# Altium project PCB_TXmodule.PrjPcb
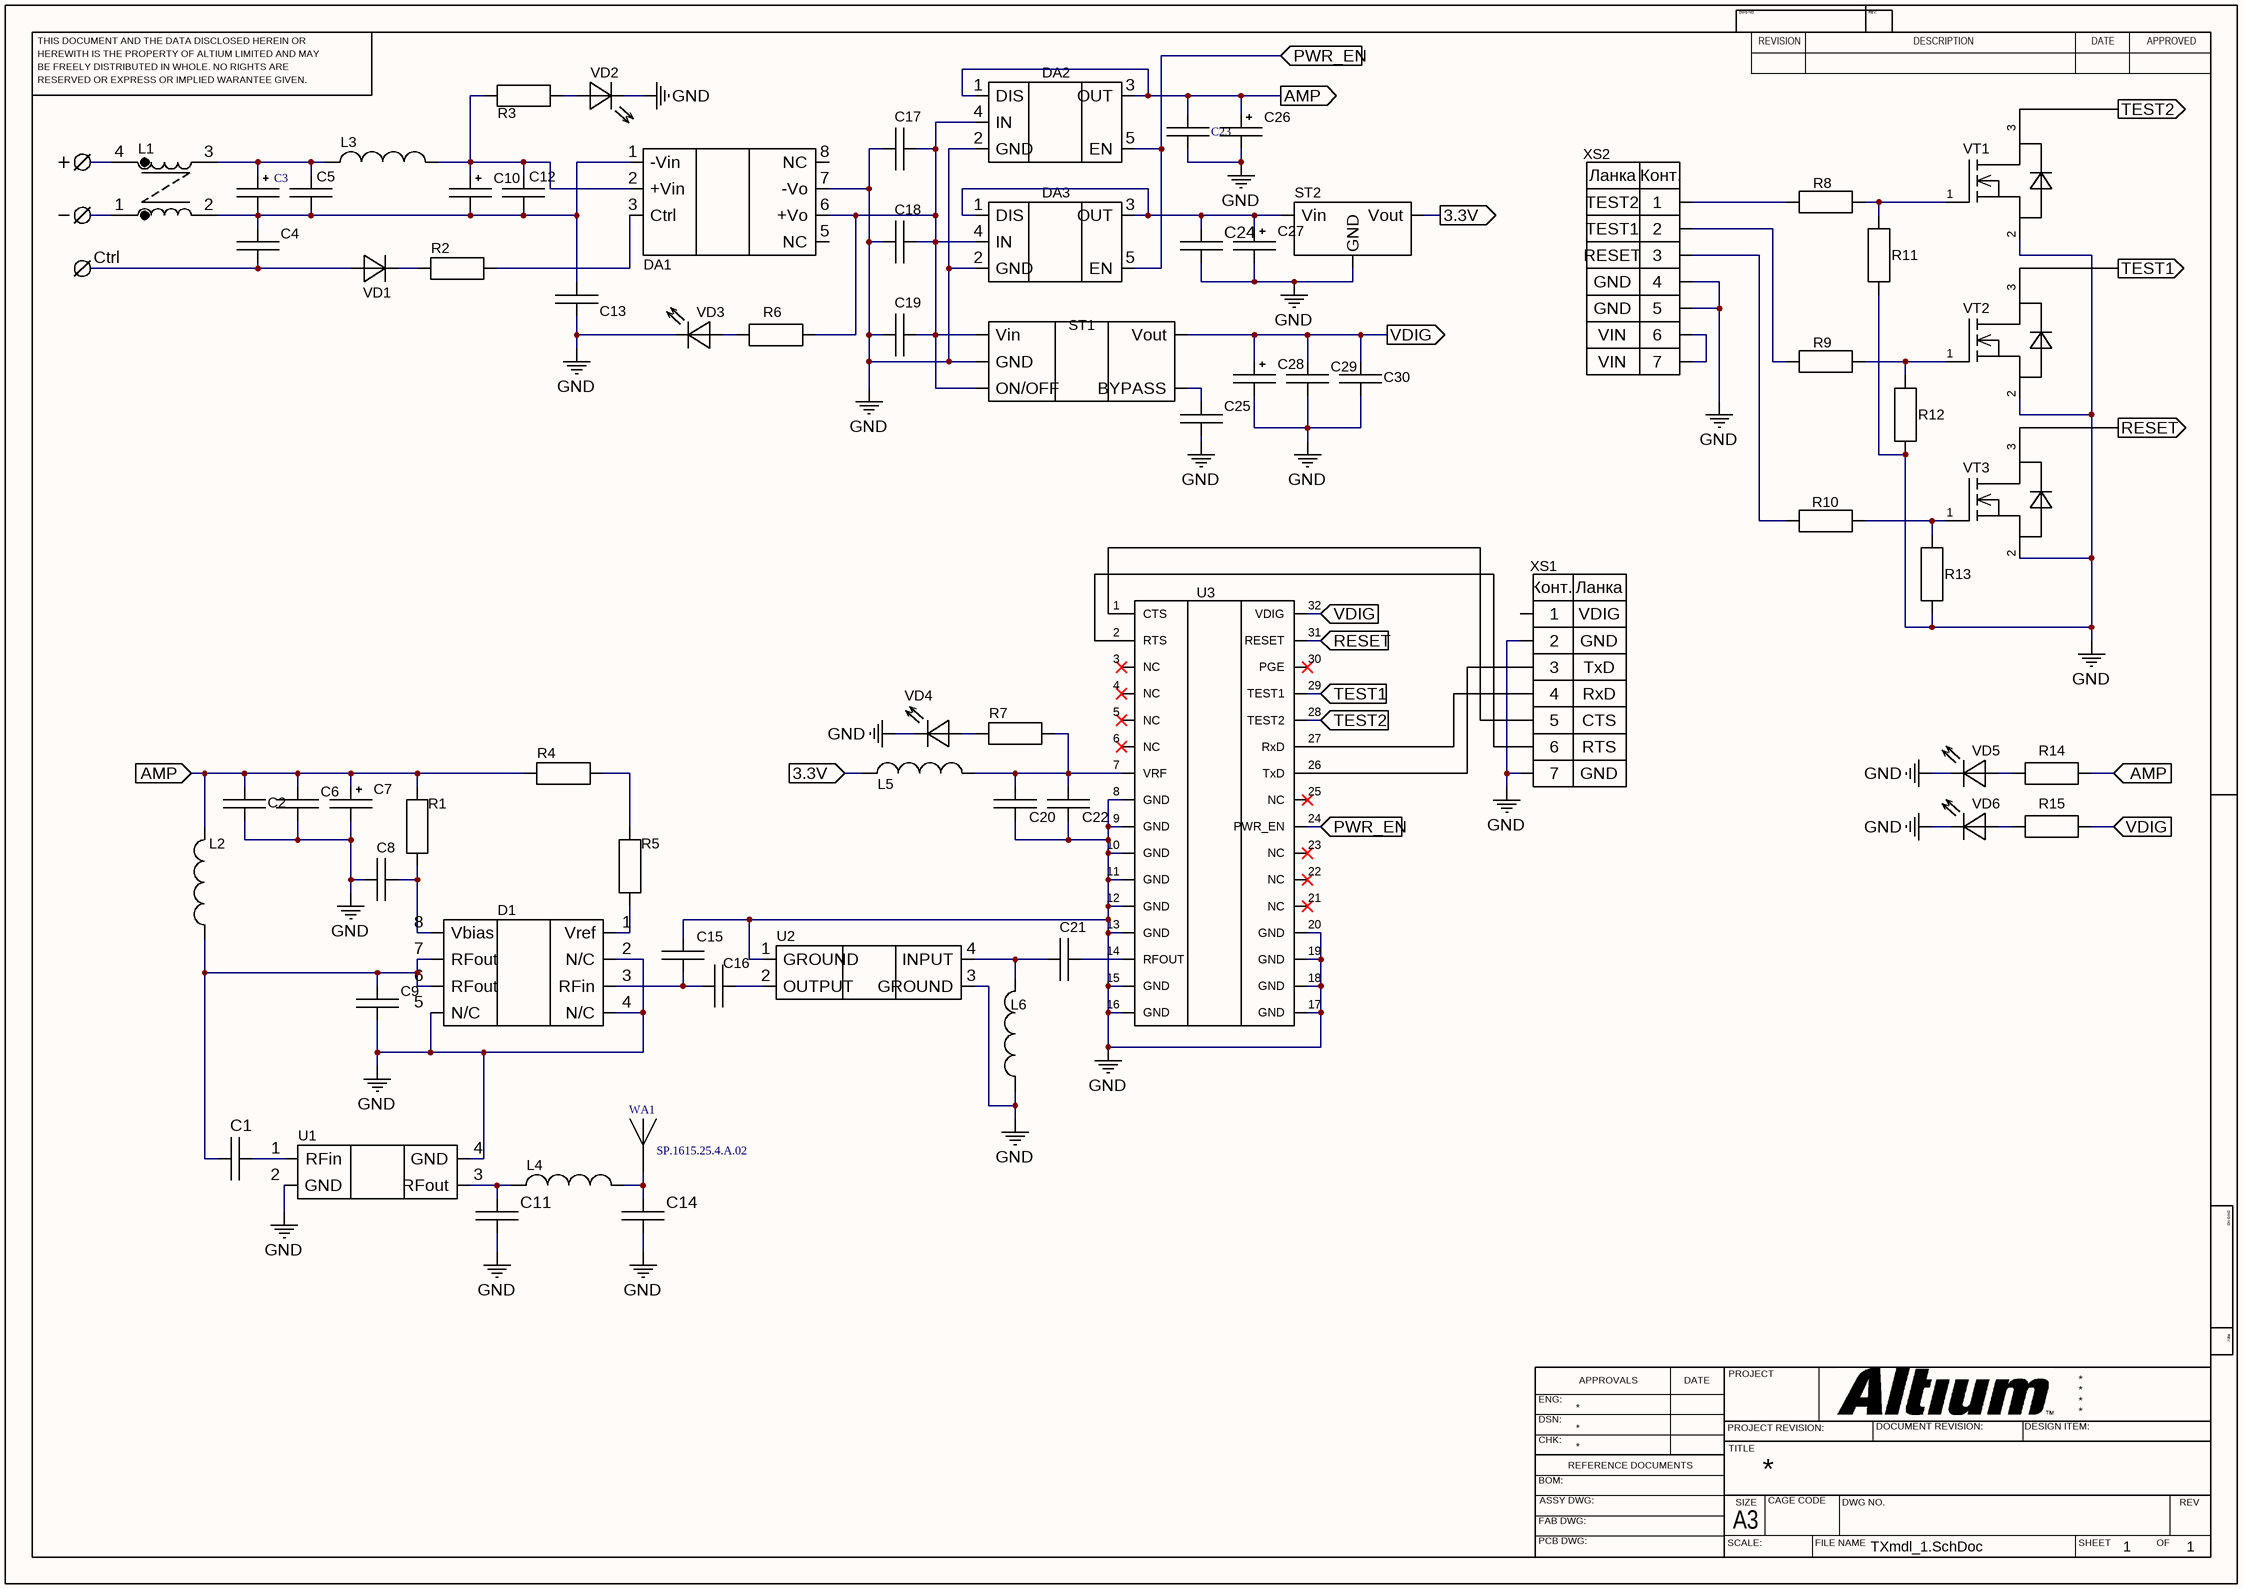
[diagram p0: TXmdl_1.SchDoc]
1 sheet, 72 parts. Net scope: flat (ports and power ports of the same name join across sheets).
Board file: PCB_STX3.PcbDoc

## Sheet TXmdl_1.SchDoc
size 420 x 297 mm; SheetNumber: 1; SheetTotal: 1

### Parts
C1  Capacitor  [CAP 0603]  (value not drawn)
C2  Capacitor  [CAP 0603]  (value not drawn)
C3  CAP_POL  [CP_Elec_SMD_10x10.5]  (value not drawn)
C4  Capacitor  [CAP 1210]  (value not drawn)
C5  Capacitor  [CAP 1206]  (value not drawn)
C6  Capacitor  [CAP 0603]  (value not drawn)
C7  CAP_POL  [TANTAL_C]  (value not drawn)
C8  Capacitor  [CAP 0603]  (value not drawn)
C9  Capacitor  [CAP 0603]  (value not drawn)
C10  CAP_POL  [CP_Elec_SMD_10x10.5]  (value not drawn)
C11  Capacitor  [CAP 0402]  (value not drawn)
C12  Capacitor  [CAP 1206]  (value not drawn)
C13  Capacitor  [CAP 1206]  (value not drawn)
C14  Capacitor  [CAP 0402]  (value not drawn)
C15  Capacitor  [CAP 0603]  (value not drawn)
C16  Capacitor  [CAP 0402]  (value not drawn)
C17  Capacitor  [CAP 0603]  (value not drawn)
C18  Capacitor  [CAP 0603]  (value not drawn)
C19  Capacitor  [CAP 0603]  (value not drawn)
C20  Capacitor  [CAP 0603]  (value not drawn)
C21  Capacitor  [CAP 0402]  (value not drawn)
C22  Capacitor  [CAP 0402]  (value not drawn)
C23  Capacitor  [CAP 0603]  (value not drawn)
C24  Capacitor  [CAP 0603]  (value not drawn)
C25  Capacitor  [CAP 0603]  (value not drawn)
C26  CAP_POL  [TANTAL_C]  (value not drawn)
C27  CAP_POL  [TANTAL_B]  (value not drawn)
C28  CAP_POL  [TANTAL_A]  (value not drawn)
C29  Capacitor  [CAP 0603]  (value not drawn)
C30  Capacitor  [CAP 0603]  (value not drawn)
D1  AH312-S8G  [SOIC-8]  (value not drawn)
DA1  URB4805S_10WR3  [URB(A)_S-10WR3]  (value not drawn)
DA2  AP2280  [SOT25]  (value not drawn)
DA3  AP2280  [SOT25]  (value not drawn)
L1  Toroidal_Chokes  [XFMR_HCTC-4-1.7]  (value not drawn)
L2  Inductance  [L 0603]  (value not drawn)
L3  Inductance  [SSB0503]  (value not drawn)
L4  Inductance  [L 0603]  (value not drawn)
L5  Ferrite_Bead  [L 0805]  (value not drawn)
L6  Inductance  [L 0603]  (value not drawn)
R1  Resistor  [RES 0603]  (value not drawn)
R2  Resistor  [RES 0603]  (value not drawn)
R3  Resistor  [RES 0603]  (value not drawn)
R4  Resistor  [RES 0603]  (value not drawn)
R5  Resistor  [RES 0603]  (value not drawn)
R6  Resistor  [RES 0603]  (value not drawn)
R7  Resistor  [RES 0603]  (value not drawn)
R8  Resistor  [RES 0603]  (value not drawn)
R9  Resistor  [RES 0603]  (value not drawn)
R10  Resistor  [RES 0603]  (value not drawn)
R11  Resistor  [RES 0603]  (value not drawn)
R12  Resistor  [RES 0603]  (value not drawn)
R13  Resistor  [RES 0603]  (value not drawn)
R14  Resistor  [RES 0603]  (value not drawn)
R15  Resistor  [RES 0603]  (value not drawn)
ST1  LP2985-33  [SOT-23_1.45]  (value not drawn)
ST2  LD1117-33  [DPAK_TO-252]  (value not drawn)
U1  BFCN-1860+  [FV1206-4]  (value not drawn)
U2  LAT-2+  [SOT143]  (value not drawn)
U3  STX3_Module  [STX3_TxSTL_32]  (value not drawn)
VD1  1N4148WS  [SOD323]  (value not drawn)
VD2  LED  [LED_SMD_0603]  (value not drawn)
VD3  LED  [LED_SMD_0603]  (value not drawn)
VD4  LED  [LED_SMD_0603]  (value not drawn)
VD5  LED  [LED_SMD_0603]  (value not drawn)
VD6  LED  [LED_SMD_0603]  (value not drawn)
VT1  2N7002  [SOT-23-3]  (value not drawn)
VT2  2N7002  [SOT-23-3]  (value not drawn)
VT3  2N7002  [SOT-23-3]  (value not drawn)
WA1  SP.1615.25.4.A.02  [A1615_25x25x4]
XS1  WPH-3002-1XX-2GXB-XR  [TSM-107-02-L-SV-A-P]  (value not drawn)
XS2  WPH-3002-1XX-2GXB-XR  [TSM-107-02-L-SV-A-P]  (value not drawn)

### Ports
3.3V (in, see TXmdl_1[4A]), 3.3V (out, see TXmdl_1[3B]), AMP (in, see TXmdl_1[1B], TXmdl_1[4A]), AMP (in, see TXmdl_1[4A], TXmdl_1[6B]), AMP (out, see TXmdl_1[1B], TXmdl_1[6B]), PWR_EN (in, see TXmdl_1[4A]), PWR_EN (in, see TXmdl_1[4C]), RESET (in, see TXmdl_1[6B]), RESET (out, see TXmdl_1[4B]), TEST1 (in, see TXmdl_1[6A]), TEST1 (out, see TXmdl_1[4B]), TEST2 (in, see TXmdl_1[6A]), TEST2 (out, see TXmdl_1[4B]), VDIG (in, see TXmdl_1[4A], TXmdl_1[4B]), VDIG (in, see TXmdl_1[4A], TXmdl_1[6C]), VDIG (out, see TXmdl_1[4B], TXmdl_1[6C])

### Nets
GND: C2.2 C6.2 C7.2 C8.1 C9.2 C11.2 C13.2 C14.2 C15.1 C17.2 C18.2 C19.1 C20.2 C22.1 C23.2 C24.2 C25.1 C26.2 C27.2 C28.2 C29.1 C30.1 D1.2(N/C) D1.4(N/C) D1.5(N/C) DA1.7(-Vo) DA2.2(GND) DA3.2(GND) L6.1 R11.1 R12.1 R13.1 ST1.2(GND) ST2.1(GND) U1.2(GND) U1.4(GND) U2.1(GROUND) U2.3(GROUND) U3.8(GND) U3.9(GND) U3.10(GND) U3.11(GND) U3.12(GND) U3.13(GND) U3.15(GND) U3.16(GND) U3.17(GND) U3.18(GND) U3.19(GND) U3.20(GND) VD2.2 VD3.2 VD4.2 VD5.2 VD6.2 VT1.2(S) VT2.2(S) VT3.2(S) XS1.2 XS1.7 XS2.4 XS2.5
Ctrl: C4.2 VD1.2
NetC1_1: C1.1 C9.1 D1.6(RFout) D1.7(RFout) L2.1
NetC1_2: C1.2 U1.1(RFin)
NetC2_1: C2.1 C6.1 C7.1 C23.1 C26.1 DA2.1(DIS) DA2.3(OUT) L2.2 R1.2 R4.1 R14.1 ; port AMP
NetC3_1: C3.1 C5.2 L1.3 L3.1
NetC3_2: C3.2 C4.1 C5.1 C10.2 C12.1 C13.1 DA1.1(-Vin) L1.2
NetC8_2: C8.2 D1.8(Vbias) R1.1
NetC10_1: C10.1 C12.2 DA1.2(+Vin) L3.2 R3.1
NetC11_1: C11.1 L4.1 U1.3(RFout)
NetC14_1: C14.1 L4.2 WA1.1
NetC15_2: C15.2 C16.1 D1.3(RFin)
NetC16_2: C16.2 U2.2(OUTPUT)
NetC17_1: C17.1 C18.1 C19.2 DA1.6(+Vo) DA2.4(IN) DA3.4(IN) R6.1 ST1.1(Vin) ST1.3(ON/OFF)
NetC20_1: C20.1 C22.2 L5.2 R7.1 U3.7(VRF)
NetC21_1: C21.1 L6.2 U2.4(INPUT)
NetC21_2: C21.2 U3.14(RFOUT)
NetC24_1: C24.1 C27.1 DA3.1(DIS) DA3.3(OUT) ST2.3(Vin)
NetC25_2: C25.2 ST1.4(BYPASS)
NetC28_1: C28.1 C29.2 C30.2 R15.1 ST1.5(Vout) U3.32(VDIG) ; port VDIG
NetD1_1: D1.1(Vref) R5.1
NetDA1_3: DA1.3(Ctrl) R2.2
NetDA2_5: DA2.5(EN) DA3.5(EN) U3.24(PWR_EN) ; port PWR_EN
NetL5_1: L5.1 ST2.2(Vout) ; port 3.3V
NetR2_1: R2.1 VD1.1
NetR3_2: R3.2 VD2.1
NetR4_2: R4.2 R5.2
NetR6_2: R6.2 VD3.1
NetR7_2: R7.2 VD4.1
NetR8_1: R8.1 R11.2 VT1.1(G)
NetR8_2: R8.2 XS2.1
NetR9_1: R9.1 R12.2 VT2.1(G)
NetR9_2: R9.2 XS2.2
NetR10_1: R10.1 R13.2 VT3.1(G)
NetR10_2: R10.2 XS2.3
NetR14_2: R14.2 VD5.1
NetR15_2: R15.2 VD6.1
NetU3_1: U3.1(CTS) XS1.5
NetU3_2: U3.2(RTS) XS1.6
NetU3_26: U3.26(TxD) XS1.3
NetU3_27: U3.27(RxD) XS1.4
NetU3_28: U3.28(TEST2) VT1.3(D) ; port TEST2
NetU3_29: U3.29(TEST1) VT2.3(D) ; port TEST1
NetU3_31: U3.31(RESET) VT3.3(D) ; port RESET
NetXS2_6: XS2.6 XS2.7

Not connected (* = marked no-connect by the designer): DA1 5(NC) 8(NC); L1 1 4; U3 3(NC)* 4(NC)* 5(NC)* 6(NC)* 21(NC)* 22(NC)* 23(NC)* 25(NC)* 30(PGE)*; XS1 1

### Notes on the sheet
- (near XS2) TEST2
- (near XS2) TEST1
- (near XS2) RESET
- (near XS2) VIN
- (near XS2) GND
- (near XS1) VDIG
- (near XS1) GND
- (near XS1) TxD
- (near XS1) RxD
- (near XS1) CTS
- (near XS1) RTS
- THIS DOCUMENT AND THE DATA DISCLOSED HEREIN OR
- HEREWITH IS THE PROPERTY OF ALTIUM LIMITED AND MAY
- DWG NO:
- REVISION
- REV:
- DESCRIPTION
- DATE
- APPROVED
- BE FREELY DISTRIBUTED IN WHOLE. NO RIGHTS ARE
- RESERVED OR EXPRESS OR IMPLIED WARANTEE GIVEN.
- ENG:
- APPROVALS
- PROJECT
- DSN:
- CHK:
- REFERENCE DOCUMENTS
- PROJECT REVISION:
- TITLE
- DOCUMENT REVISION:
- DESIGN ITEM:
- BOM:
- FAB DWG:
- PCB DWG:
- ASSY DWG:
- SCALE:
- A3
- SIZE
- CAGE CODE
- FILE NAME
- DWG NO.
- SHEET
- OF
- REV
- (in symbol WPH-3002-1XX-2GXB-XR) Конт.; Ланка

### Library data of the parts
C1 C8 C15 C20 C25 C29 C30 = Capacitor CAP 0603 10 pF: Library Part: Capacitor.schlib; Value: 10; Units: pF; Part Number: Capacitor CAP 0603 10 pF; Footprint Part: PcbLibCAP.pcbLib
C2 C6 C9 = Capacitor CAP 0603 100 pF: Library Part: Capacitor.schlib; Value: 100; Units: pF; Part Number: Capacitor CAP 0603 100 pF; Footprint Part: PcbLibCAP.pcbLib
C3 C10 = CAP_POL CP_Elec_SMD_10x10.5 100 uF: Library Part: Capacitor.schlib; Value: 100; Units: uF; Rated Voltage: 50V; Tolerance: 0,1; Part Number: CAP_POL CP_Elec_SMD_10x10.5 100 uF; Footprint Part: PcbLibCAP.pcbLib
C4 = Capacitor CAP 1210 10 uF: Library Part: Capacitor.schlib; Value: 10; Units: uF; Rated Voltage: 50V; Tolerance: 0,1; Part Number: Capacitor CAP 1210 10 uF; Footprint Part: PcbLibCAP.pcbLib
C5 C12 C13 = Capacitor CAP 1206 10 uF: Library Part: Capacitor.schlib; Value: 10; Units: uF; Rated Voltage: 50V; Tolerance: 0,1; Part Number: Capacitor CAP 1206 10 uF; Footprint Part: PcbLibCAP.pcbLib
C7 = CAP_POL TANTAL_C 47 uF: Library Part: Capacitor.schlib; Value: 47; Units: uF; Part Number: CAP_POL TANTAL_C 47 uF; Footprint Part: PcbLibCAP.pcbLib
C11 C14 C16 C21 = Capacitor CAP 0402 1 pF: Library Part: Capacitor.schlib; Value: 1; Units: pF; Part Number: Capacitor CAP 0402 1 pF; Footprint Part: PcbLibCAP.pcbLib
C17-C19 = Capacitor CAP 0603 1 uF: Library Part: Capacitor.schlib; Value: 1; Units: uF; Part Number: Capacitor CAP 0603 1 uF; Footprint Part: PcbLibCAP.pcbLib
C22 = Capacitor CAP 0402 0.1 uF: Library Part: Capacitor.schlib; Value: 0.1; Units: uF; Part Number: Capacitor CAP 0402 0.1 uF; Footprint Part: PcbLibCAP.pcbLib
C23 C24 = Capacitor CAP 0603 0.1 uF: Library Part: Capacitor.schlib; Value: 0.1; Units: uF; Part Number: Capacitor CAP 0603 0.1 uF; Footprint Part: PcbLibCAP.pcbLib
C26 = CAP_POL TANTAL_C 10 uF: Library Part: Capacitor.schlib; Value: 10; Units: uF; Rated Voltage: 35V; Tolerance: 0,1; Part Number: CAP_POL TANTAL_C 10 uF; Footprint Part: PcbLibCAP.pcbLib
D1 = AH312-S8G SOIC-8: 400–2300 MHz / +33 dBm P1dB at 2140 MHz / +48 dBm Output IP3 at 2140 MHz / 18 dB Gain at 900 MHz / +5 V Single Positive Supply; Library Part: Amplifier.schlib; Part Number: AH312-S8G SOIC-8; Footprint Part: PcbLibAMP.pcbLib
DA1 = URB4805S_10WR3: Hi-Link / IN: 18-75VDC / OUT: 5VDC/2000mA / Power: 10 W; Library Part: DC_DC_Converter.schlib; Part Number: URB4805S_10WR3; Footprint Part: PcbLibDC_DC.pcbLib
DA2 DA3 = AP2280 SOT25: Library Part: LoadSwitch.schLib; Part Number: AP2280 SOT25; Footprint Part: PcbLibLSW.pcbLib
L2 L4 L6 = Inductance L 0603 39 nH: Library Part: Inductance.schlib; Value: 39; Units: nH; Part Number: Inductance L 0603 39 nH; Footprint Part: PcbLibL.pcbLib
L3 = Inductance SSB0503 15 uH: Library Part: Inductance.schlib; Value: 15; Units: uH; Part Number: Inductance SSB0503 15 uH; Footprint Part: PcbLibL.pcbLib
L5 = Ferrite_Bead L 0805 220 Om: Library Part: Inductance.schlib; Value: 220; Units: Om; Part Number: Ferrite_Bead L 0805 220 Om; Footprint Part: PcbLibL.pcbLib
R1 R4 R5 = Resistor RES 0603 0 Om: Library Part: Resistor.schlib; Value: 0; Units: Om; Part Number: Resistor RES 0603 0 Om; Footprint Part: PcbLibRES.pcbLib
R2 = Resistor RES 0603 100 Om: Library Part: Resistor.schlib; Value: 100; Units: Om; Part Number: Resistor RES 0603 100 Om; Footprint Part: PcbLibRES.pcbLib
R3 R6 R7 R14 R15 = Resistor RES 0603 4.7 kOm: Library Part: Resistor.schlib; Value: 4.7; Units: kOm; Part Number: Resistor RES 0603 4.7 kOm; Footprint Part: PcbLibRES.pcbLib
R8-R13 = Resistor RES 0603 1 Om: Library Part: Resistor.schlib; Value: 1; Units: Om; Part Number: Resistor RES 0603 1 Om; Footprint Part: PcbLibRES.pcbLib
ST1 = LP2985-33 SOT-23_1.45: Library Part: LDO.schlib; Part Number: LP2985-33 SOT-23_1.45; Footprint Part: PcbLibLDO.pcbLib
ST2 = LD1117-33 DPAK_TO-252: Library Part: LDO.schlib; Part Number: LD1117-33 DPAK_TO-252; Footprint Part: PcbLibLDO.pcbLib
U1 = BFCN-1860+ FV1206-4: Bandpass Filter / 1580 to 2200 MHz; Library Part: Filter.schlib; Part Number: BFCN-1860+ FV1206-4; Footprint Part: PcbLibFILTR.pcbLib
U2 = LAT-2+ SOT143: wideband, DC to 2500 MHz; Library Part: RF_Attenuator.schlib; Part Number: LAT-2+ SOT143; Footprint Part: PcbLibRFATTN.pcbLib
U3 = STX3_Module STX3_TxSTL_32: STX3 satellite transmitter; Library Part: TRANSMITTER.schlib; Part Number: STX3_Module STX3_TxSTL_32; Footprint Part: PcbLibTxTER.pcbLib
VD1 = 1N4148WS SOD323: High Speed Switching Diode / Features / - VR 75V / - IFAV 150mA; Library Part: Diode.schlib; Part Number: 1N4148WS SOD323; Footprint Part: PcbLibDIODE.pcbLib
VD2-VD6 = LED_RGB LED_SMD_0603: Library Part: LED.schlib; Part Number: LED_RGB LED_SMD_0603; Footprint Part: PcbLibLED.pcbLib
VT1-VT3 = 2N7002 SOT-23-3: Library Part: MOSFET.schlib; Part Number: 2N7002 SOT-23-3; Footprint Part: PcbLibMOSFET.pcbLib
WA1 = SP.1615.25.4.A.02 A1615_25x25x4: 25*25*4mm  Globalstar 25mm 1615Mhz; Library Part: Antenna.schlib; Part Number: SP.1615.25.4.A.02 A1615_25x25x4; Footprint Part: PcbLibANTNN.pcbLib